# EAGLE design out8-V2.1 (EAGLE 9.6.2)
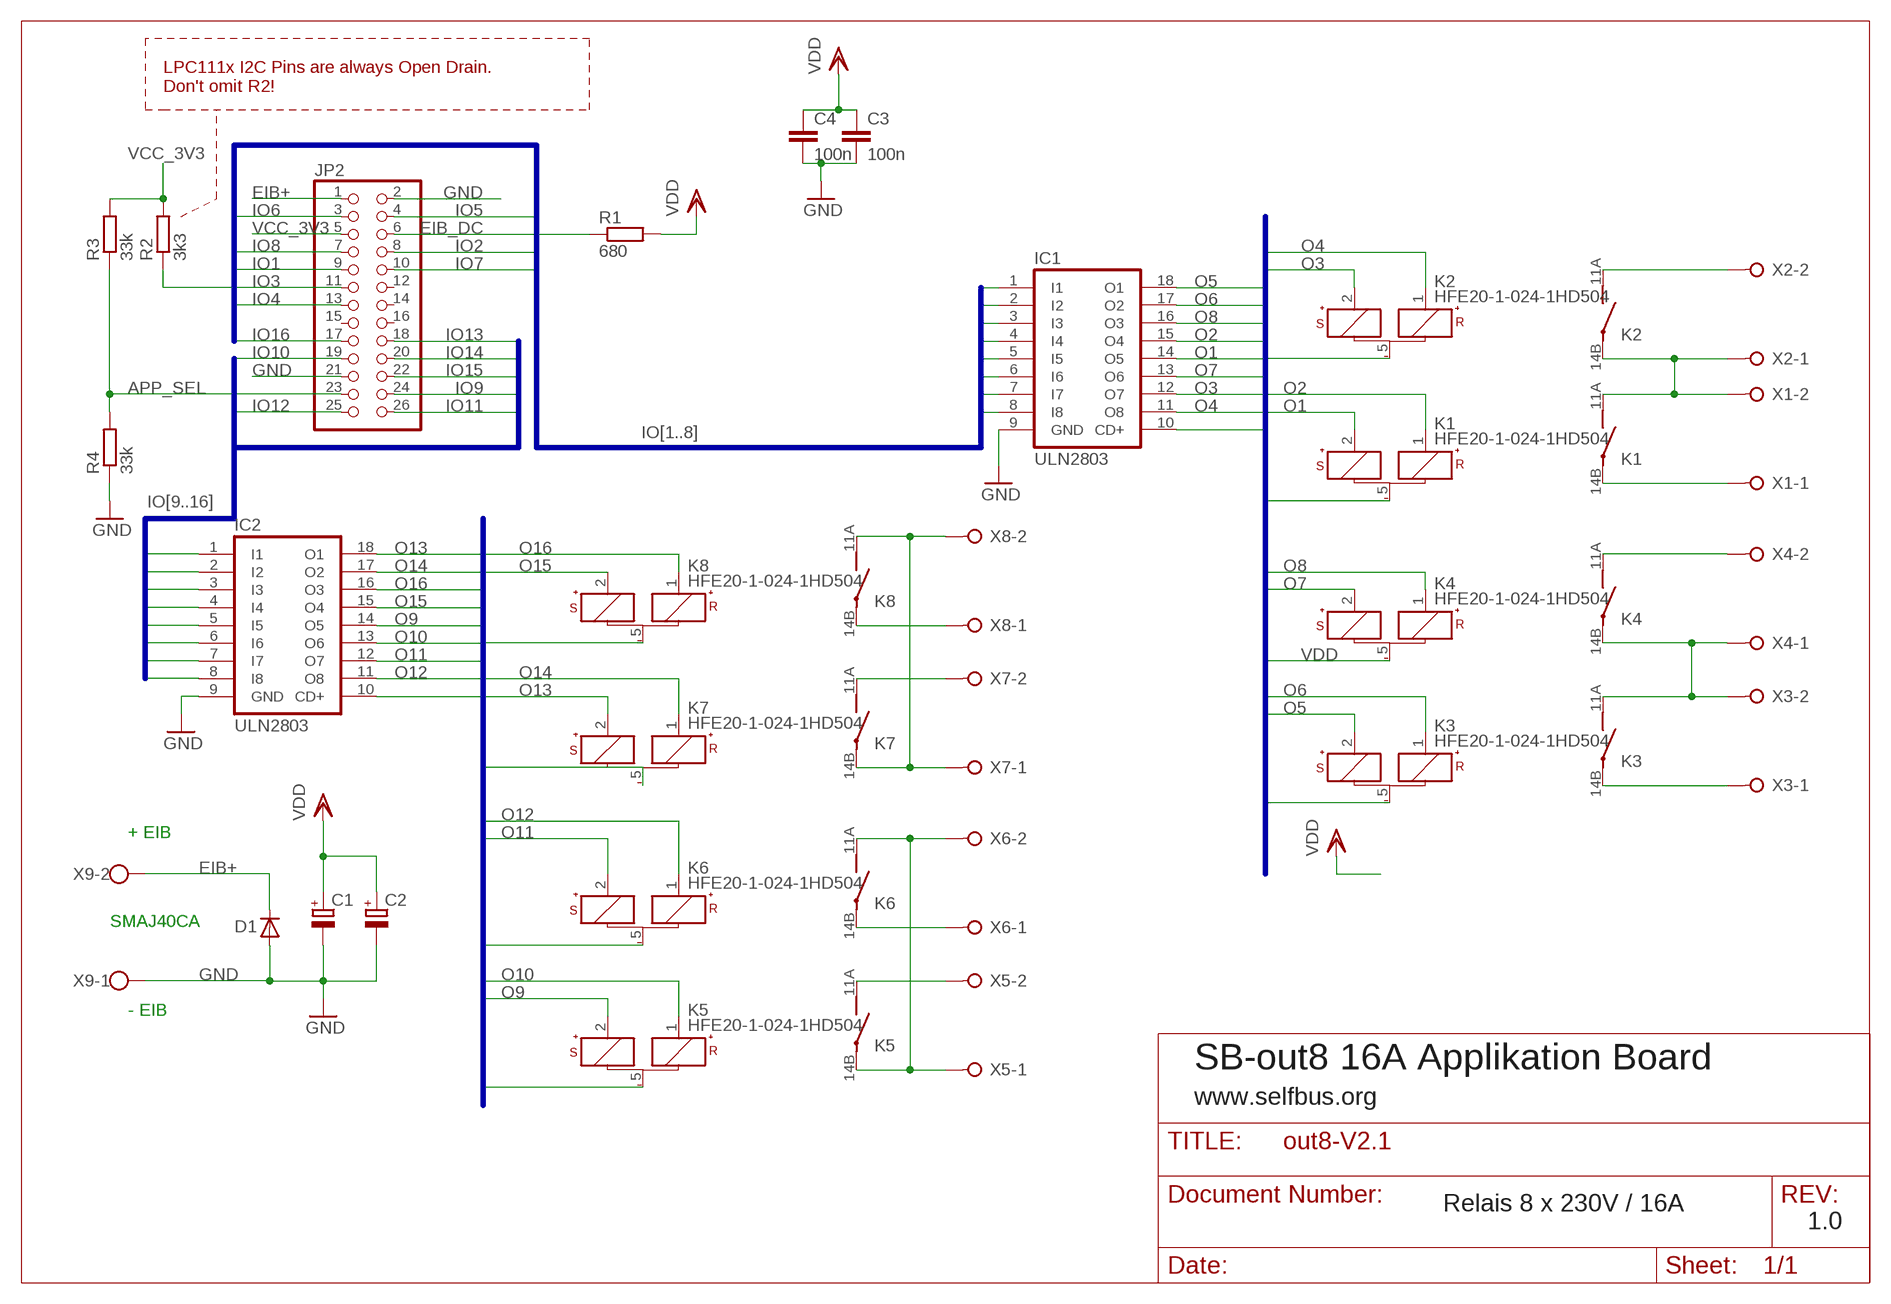
[diagram p0: schematic, sheet 1]

## Parts
C1  CPOL-EUE3.5-8  [E3,5-8]
C2  CPOL-EUE3.5-8  [E3,5-8]
C3  100n  C-EUC1206  [C1206]
C4  100n  C-EUC1206  [C1206]
D1  D-SMB  [SMB]
IC1  ULN2803  ULN2803ASOP18  [SO18W]
IC2  ULN2803  ULN2803ASOP18  [SO18W]
JP2  PINHD-2X13_2.54-SMD  [2X13SMD]
K1  HFE20-1-024-1HD504  [HFE20-3-504]
K2  HFE20-1-024-1HD504  [HFE20-3-504]
K3  HFE20-1-024-1HD504  [HFE20-3-504]
K4  HFE20-1-024-1HD504  [HFE20-3-504]
K5  HFE20-1-024-1HD504  [HFE20-3-504]
K6  HFE20-1-024-1HD504  [HFE20-3-504]
K7  HFE20-1-024-1HD504  [HFE20-3-504]
K8  HFE20-1-024-1HD504  [HFE20-3-504]
R1  680  R-EU_M1206  [M1206]
R2  3k3  R-EU_M1206  [M1206]
R3  33k  R-EU_M1206  [M1206]
R4  33k  R-EU_M1206  [M1206]
X1  W237-02P  [W237-132]
X2  W237-02P  [W237-132]
X3  W237-02P  [W237-132]
X4  W237-02P  [W237-132]
X5  W237-02P  [W237-132]
X6  W237-02P  [W237-132]
X7  W237-02P  [W237-132]
X8  W237-02P  [W237-132]
X9  W237-102  [W237-102]

## Nets
APP_SEL: JP2.23 R3.1 R4.2
EIB+: D1.1(C) JP2.1 X9.2
EIB_DC: JP2.6 R1.1
GND: C1.- C2.- C3.2 C4.2 D1.2(A) IC1.9(GND) IC2.9(GND) JP2.2 JP2.21 R4.1 X9.1
IO1: IC1.5(I5) JP2.9
IO2: IC1.4(I4) JP2.8
IO3: IC1.7(I7) JP2.11 R2.1
IO4: IC1.8(I8) JP2.13
IO5: IC1.1(I1) JP2.4
IO6: IC1.2(I2) JP2.3
IO7: IC1.6(I6) JP2.10
IO8: IC1.3(I3) JP2.7
IO9: IC2.5(I5) JP2.24
IO10: IC2.6(I6) JP2.19
IO11: IC2.7(I7) JP2.26
IO12: IC2.8(I8) JP2.25
IO13: IC2.1(I1) JP2.18
IO14: IC2.2(I2) JP2.20
IO15: IC2.4(I4) JP2.22
IO16: IC2.3(I3) JP2.17
K12: K1.11A(PB) K2.14B(PA) X1.2 X2.1
K34: K3.11A(PB) K4.14B(PA) X3.2 X4.1
K56: K5.14B(PA) K6.11A(PB) X5.1 X6.2
K78: K7.14B(PA) K8.11A(PB) X7.1 X8.2
N$1: K4.11A(PB) X4.2
N$2: K8.14B(PA) X8.1
N$3: K1.14B(PA) X1.1
N$4: K3.14B(PA) X3.1
N$8: K2.11A(PB) X2.2
N$11: K7.11A(PB) X7.2
N$13: K5.11A(PB) X5.2
N$14: K6.14B(PA) X6.1
O1: IC1.14(O5) K1.2(S+)
O2: IC1.15(O4) K1.1(R+)
O3: IC1.12(O7) K2.2(S+)
O4: IC1.11(O8) K2.1(R+)
O5: IC1.18(O1) K3.2(S+)
O6: IC1.17(O2) K3.1(R+)
O7: IC1.13(O6) K4.2(S+)
O8: IC1.16(O3) K4.1(R+)
O9: IC2.14(O5) K5.2(S+)
O10: IC2.13(O6) K5.1(R+)
O11: IC2.12(O7) K6.2(S+)
O12: IC2.11(O8) K6.1(R+)
O13: IC2.18(O1) K7.2(S+)
O14: IC2.17(O2) K7.1(R+)
O15: IC2.15(O4) K8.2(S+)
O16: IC2.16(O3) K8.1(R+)
VCC_3V3: JP2.5 R2.2 R3.2
VDD: C1.+ C2.+ C3.1 C4.1 IC1.10(CD+) IC2.10(CD+) K1.5(-) K2.5(-) K3.5(-) K4.5(-) K5.5(-) K6.5(-) K7.5(-) K8.5(-) R1.2
Unconnected: JP2.12 JP2.14 JP2.15 JP2.16

## Buses
IO[1..8]
O[1..8],VDD
O[9..16],VDD
IO[9..16]

## Notes on the sheet
- LPC111x I2C Pins are always Open Drain.
  Don't omit R2!
- + EIB
- SMAJ40CA
- - EIB
- SB-out8 16A Applikation Board
- www.selfbus.org
- Relais 8 x 230V / 16A
- 1.0

## Library data of the parts
C1 C2 = rcl:CPOL-EU: POLARIZED CAPACITOR, European symbol
C3 C4 = rcl:C-EU: CAPACITOR, European symbol
D1 = semicon-smd-ipc:D-: DIODE unfilled
IC1 IC2 = uln-udn:ULN2803A: DRIVER ARRAY
JP2 = pinhead:PINHD-2X13: PIN HEADER
K1-K8 = sb-relay:HFE20-1-024-1HD
R1-R4 = rcl:R-EU_: RESISTOR, European symbol
X1-X8 = con-wago-508:W237-02P: WAGO SREW CLAMP; OC_FARNELL: unknown; OC_NEWARK: unknown
X9 = con-wago-500:W237-102: WAGO SCREW CLAMP

## Net classes
1 230Vac: width 1.93 mm, clearance 5.08 mm to class 0, clearance 1.905 mm

## Board
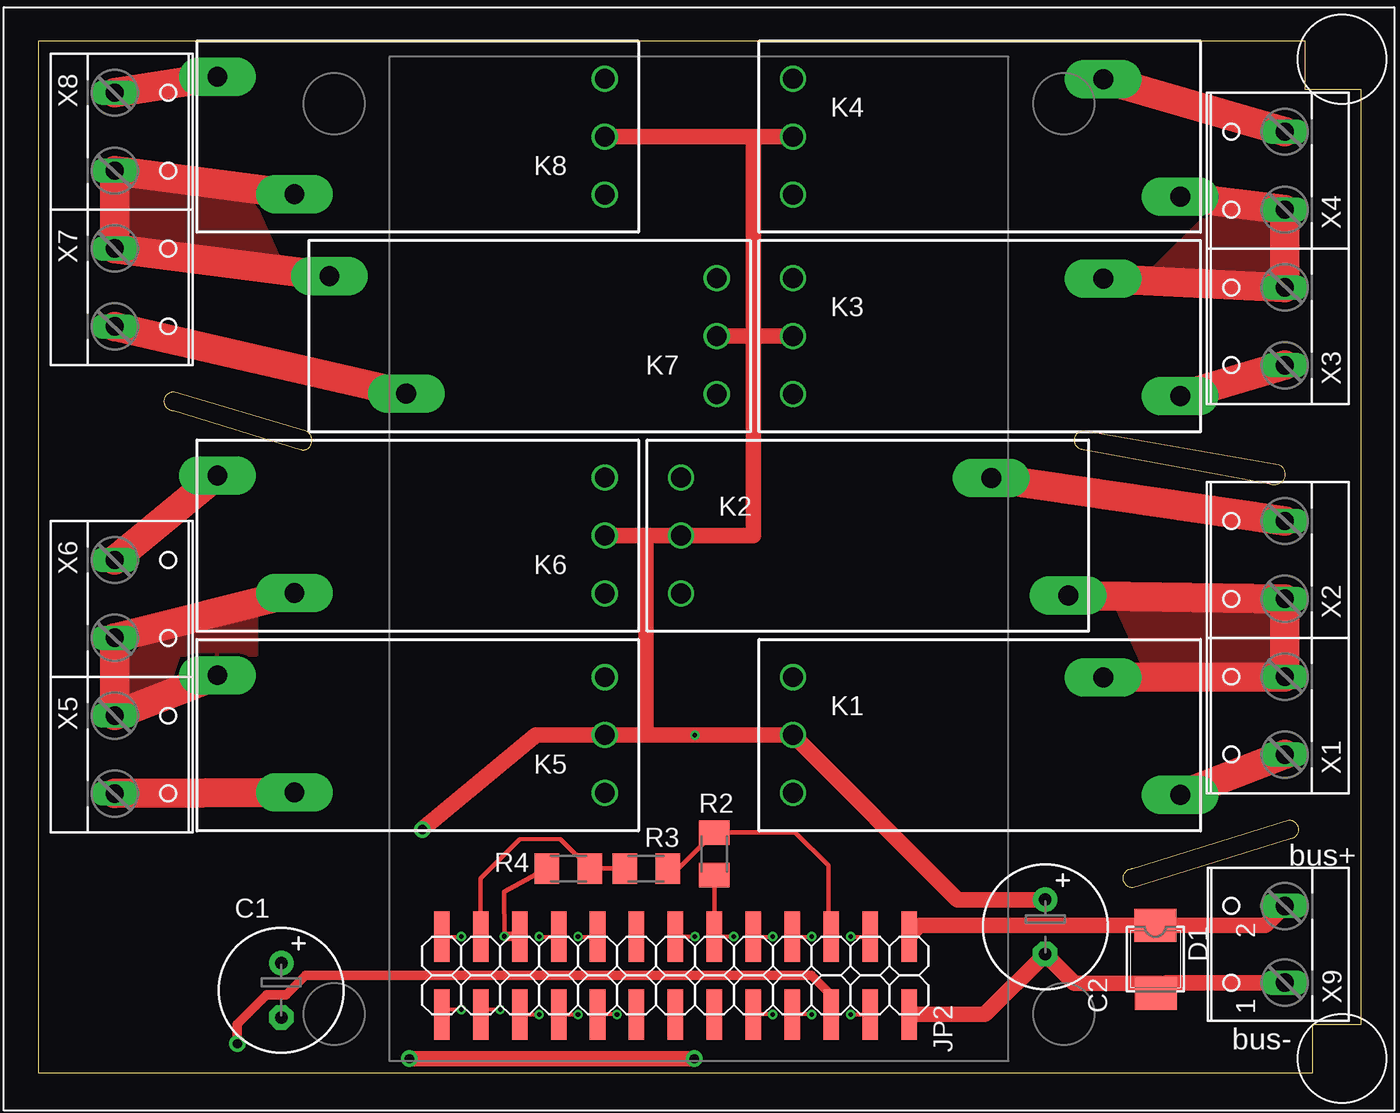
[diagram p1: board, top side]
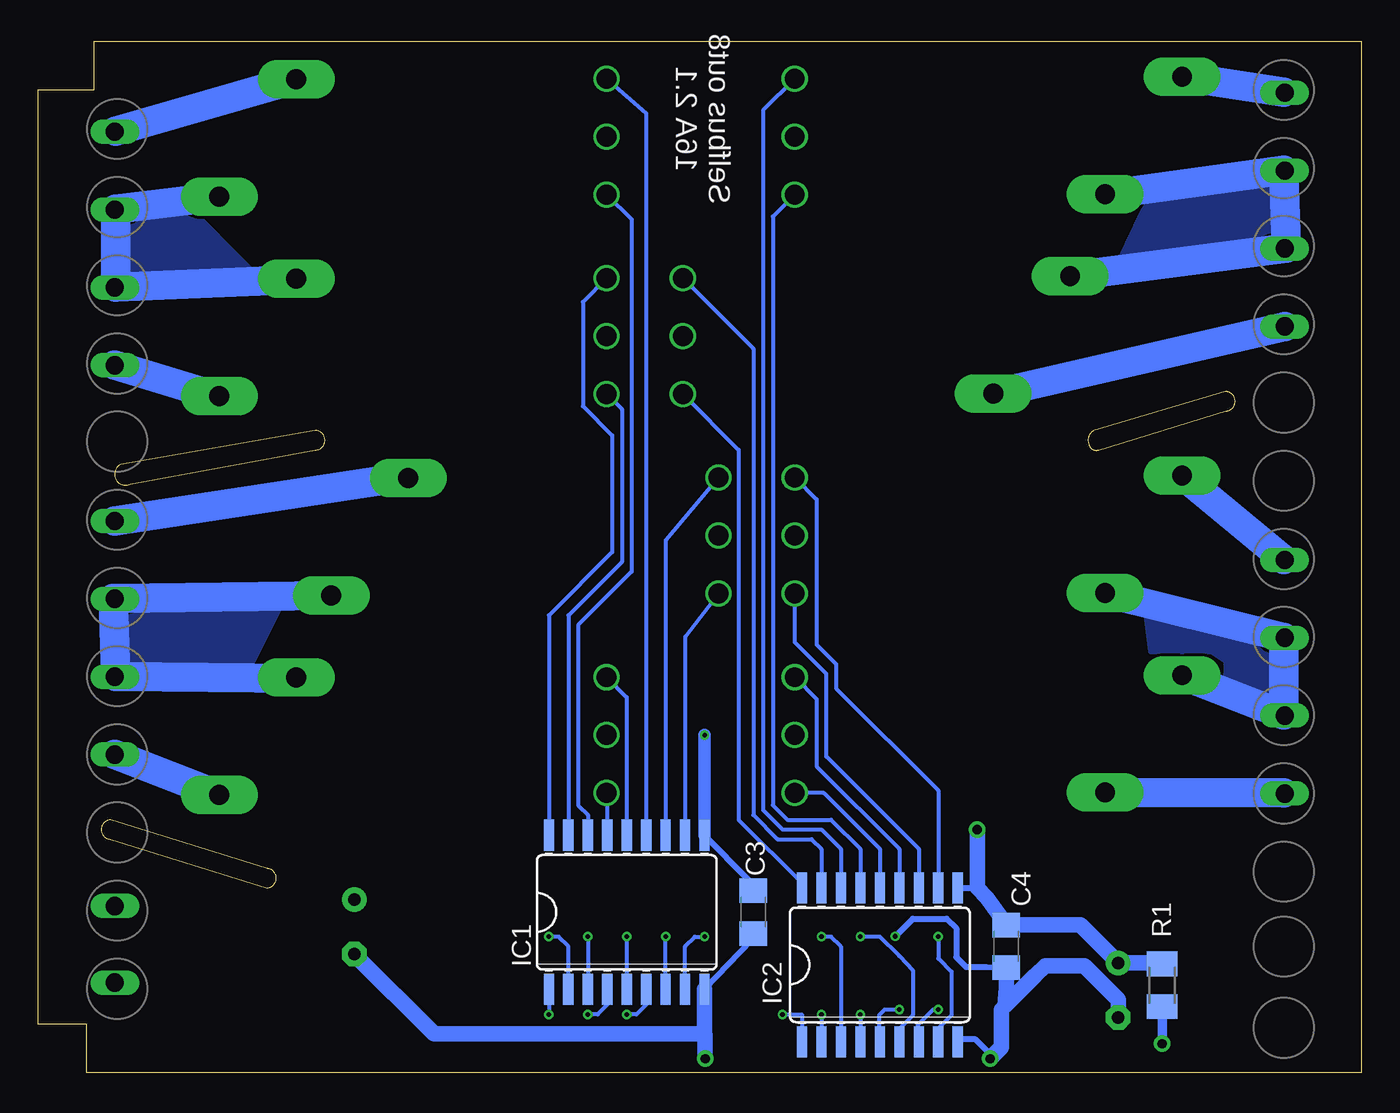
[diagram p2: board, bottom side, seen from below]

Size 86.3 x 67.31 mm. Coordinates in mm from the lower left corner, seen from the top.
Outline: 8.22,43.81 arc-90 8.86,44.45 17.43,41.91 arc-90 17.75,40.96 arc-90 17.11,40.64 8.86,43.18 arc-90 8.22,43.81
Outline: 67.6,41.27 arc-90 68.23,41.91 80.93,39.69 arc-90 81.25,38.73 arc-90 80.3,38.42 68.23,40.64 arc-90 67.6,41.27
Outline: 70.77,12.7 arc-90 71.41,13.33 81.57,16.51 arc-90 82.2,15.87 arc-90 81.57,15.24 71.41,12.06 arc-90 70.77,12.7
Copper layers (1*16): Top 0.035mm / dielectric 1.5mm / Bottom 0.035mm
Design rules "PCB-POOL Standard *": minimum track width 0.15mm, minimum drill 0.3mm, track to track 0.15mm, track to pad 0.15mm, pad to pad 0.15mm, via to via 0.15mm, smd to smd 0.15mm, copper to edge 0.3mm, drill to drill 0.2mm, minimum pad ring 0.2mm, minimum via ring 0.15mm, stop-mask expansion 0.075mm, vias tented up to drill 0.35mm, thermal gap 0.2mm

### Footprints (pad centres in the part's own frame; a part is rotated, then mirrored left to right if it is on the bottom)
E3,5-8 = drill 0.813 pad 1.6: + -1.778,0 | drill 0.813 pad 1.6 octagon: - 1.778,0
C1206 = smd 1.6 x 1.8: 1 -1.4,0; 2 1.4,0
SMB = smd 2.159 x 2.743: 1 -2.311,-0.127; 2 2.108,-0.102
SO18W = smd 0.66 x 2.032: 1 -5.08,-5.029; 2 -3.81,-5.029; 3 -2.54,-5.029; 4 -1.27,-5.029; 5 0,-5.029; 6 1.27,-5.029; 7 2.54,-5.029; 8 3.81,-5.029; 9 5.08,-5.029; 10 5.08,5.029; 11 3.81,5.029; 12 2.54,5.029; 13 1.27,5.029; 14 0,5.029; 15 -1.27,5.029; 16 -2.54,5.029; 17 -3.81,5.029; 18 -5.08,5.029
2X13SMD = smd 1.016 x 3.302: 1 -1.27,-3.81; 2 -1.27,1.27; 3 1.27,-3.81; 4 1.27,1.27; 5 3.81,-3.81; 6 3.81,1.27; 7 6.35,-3.81; 8 6.35,1.27; 9 8.89,-3.81; 10 8.89,1.27; 11 11.43,-3.81; 12 11.43,1.27; 13 13.97,-3.81; 14 13.97,1.27; 15 16.51,-3.81; 16 16.51,1.27; 17 19.05,-3.81; 18 19.05,1.27; 19 21.59,-3.81; 20 21.59,1.27; 21 24.13,-3.81; 22 24.13,1.27; 23 26.67,-3.81; 24 26.67,1.27; 25 29.21,-3.81; 26 29.21,1.27
HFE20-3-504 = drill 1.3: 1 -12.6,-3.78; 2 -12.6,3.78; 5 -12.6,0 | drill 1.3 pad 2.5 long: 11A 7.65,3.75; 14B 12.67,-3.91
M1206 = smd 1.6 x 2: 1 -1.4,0; 2 1.4,0
W237-132 = drill 1.194 long: 1 -2.54,-0.635; 2 2.54,-0.635
W237-102 = drill 1.194 long: 1 -2.5,-1.27; 2 2.5,-1.27

### Placement (x,y rotation side)
C1  15.85,5.4 270 top
C2  65.69,9.52 270 top
C3  39.66,10.48 270 bottom
C4  23.16,8.25 270 bottom
D1  73,7.3 270 top
IC1  47.91,10.48 0 bottom
IC2  31.4,7.05 0 bottom
JP2  55.53,5.08 180 top
K1  61.82,22.03 0 top
K2  54.52,35.05 0 top
K3  61.82,48.07 0 top
K4  61.82,61.09 0 top
K5  24.35,22.03 180 top
K6  24.35,35.05 180 top
K7  31.66,48.07 180 top
K8  24.35,61.09 180 top
R1  12.99,5.71 90 bottom
R2  44.1,14.29 90 top
R3  39.66,13.33 0 top
R4  34.58,13.33 0 top
U$1  [HUT4C-NO-DRILL]  -2.25,69.53 270 top
X1  80.68,23.3 90 top
X2  80.68,33.46 90 top
X3  80.68,48.7 90 top
X4  80.68,58.86 90 top
X5  5.62,20.76 270 top
X6  5.62,30.92 270 top
X7  5.62,51.24 270 top
X8  5.62,61.4 270 top
X9  80.04,8.38 90 top

### Tracks (layer width: path | path; a pad name or v marks a point on that pad's centre or on a via)
APP_SEL
  Top 0.254: 34.07,15.24 31.4,15.24
  Top 0.305: R3.1 R4.2 34.07,15.24 | 31.4,15.24 28.86,12.7 JP2.23
EIB+
  Top 1.016: X9.2 80.05,9.61 D1.1 57.53,9.61 JP2.1
EIB_DC  (via drill 0.6)
  Top 0.61: JP2.6 51.72,5.08 50.45,6.35 17.43,6.35 16.16,5.08 14.89,5.08 12.99,3.17 v12.99,1.9
  Top 0.813: JP2.6 51.72,3.17
  Bottom 0.61: v12.99,1.9 R1.1
GND  (via drill 0.3, 0.6)
  Top 0.305: R4.1 30.39,11.82 v30.41,8.91
  Top 0.61: v30.41,8.91 31.39,8.91 JP2.21
  Top 0.813: 72.68,5.88 72.89,5.67 D1.2
  Top 1.016: D1.2 73.36,5.66 | 73.36,5.66 73.58,5.88 X9.1 | 73.36,5.66 73.19,5.84 67.6,5.84 C2.- 61.76,3.81 JP2.2 | v24.21,0.92 v42.79,0.92
  Bottom 0.406: C3.2 39.75,8.66 IC1.9 | 26.1,2.24 IC2.9 26.16,2.18 25.15,2.18 24.21,1.24 v24.21,0.92 | v30.41,8.91 v30.4,8.91 29.25,10.06 27.04,10.06 26.41,9.43 26.41,7.54 25.78,6.91 24.47,6.91 C4.2
  Bottom 0.61: 21.56,6.35 21.24,6.35
  Bottom 1.016: IC1.9 42.83,2.54 | 42.83,2.54 60.49,2.54 C2.- | 23.23,4.36 23.48,4.11 23.48,1.65 v24.21,0.92 | 23.23,4.36 21.24,6.35 20.61,6.98 18.07,6.98 15.85,4.76 C1.- | v42.79,0.92 42.79,2.5 42.83,2.54 | C4.2 23.16,5.54 23.23,4.36
  pour Bottom (isolate 6.452): 12.99,9.52 12.99,1.27 59.34,1.27 59.34,8.89 58.07,8.89 53.63,13.33 53.63,29.84 49.82,33.65 49.82,41.91 51.09,43.18 51.09,66.04 35.85,66.04 35.85,55.88 38.39,53.34 38.39,42.54 35.21,39.37 35.21,22.86 34.58,22.86 21.24,9.52
  pour Top (isolate 6.452): 12.99,1.27 59.34,1.27 59.34,10.16 56.8,10.16 53.63,13.33 53.63,29.84 49.82,33.65 49.82,41.91 51.09,43.18 51.09,66.04 35.85,66.04 35.85,55.88 38.39,53.34 38.39,42.54 35.21,39.37 35.21,22.86 21.88,9.52 13.62,9.52 12.99,9.52
IO1  (via drill 0.3)
  Top 0.254: JP2.9 v47.91,8.89
  Bottom 0.254: v47.91,8.89 IC1.5
IO2  (via drill 0.3)
  Top 0.254: v50.45,3.81 JP2.8
  Bottom 0.254: IC1.4 49.18,4.44 49.82,3.81 v50.45,3.81
IO3  (via drill 0.3)
  Top 0.254: v45.37,8.89 JP2.11
  Top 0.305: R2.1 JP2.11
  Bottom 0.254: IC1.7 v45.37,8.89
IO4  (via drill 0.3)
  Top 0.254: v42.83,8.89 JP2.13
  Bottom 0.254: IC1.8 44.1,8.25 43.47,8.89 v42.83,8.89
IO5  (via drill 0.3)
  Top 0.254: v52.99,3.81 JP2.4
  Bottom 0.254: IC1.1 v52.99,3.81
IO6  (via drill 0.3)
  Top 0.254: v52.99,8.89 JP2.3
  Bottom 0.254: IC1.2 51.72,8.25 52.36,8.89 v52.99,8.89
IO7  (via drill 0.3)
  Top 0.254: v47.91,3.81 JP2.10
  Bottom 0.254: IC1.6 46.64,4.44 47.28,3.81 v47.91,3.81
IO8  (via drill 0.3)
  Top 0.254: JP2.7 v50.45,8.89
  Bottom 0.254: v50.45,8.89 IC1.3
IO9  (via drill 0.3)
  Top 0.254: v30.13,4.12 29.18,4.12 JP2.24
  Bottom 0.254: v30.13,4.12 31.09,4.12 31.45,3.76 31.45,2.07 IC2.5
IO10  (via drill 0.3)
  Top 0.254: v32.67,8.89 JP2.19
  Bottom 0.254: v32.67,8.89 31.4,8.89 30.13,7.62 29.25,6.67 29.25,3.76 30.19,2.81 30.19,2.08 IC2.6
IO11  (via drill 0.3)
  Top 0.254: v27.59,4.12 26.64,4.12 JP2.26
  Bottom 0.254: v27.59,4.12 27.94,4.12 28.93,3.13 28.93,2.09 IC2.7
IO12  (via drill 0.3)
  Top 0.254: JP2.25 v27.59,8.89
  Bottom 0.254: v27.59,8.89 27.59,7.46 26.73,6.59 26.73,3.76 27.67,2.81 27.67,2.1 IC2.8
IO13  (via drill 0.3)
  Top 0.254: v37.75,3.81 JP2.18
  Bottom 0.254: v37.75,3.81 JP2.18 IC2.1
IO14  (via drill 0.3)
  Top 0.254: JP2.20 v35.21,3.81
  Bottom 0.254: v35.21,3.81 IC2.2
IO15  (via drill 0.3)
  Top 0.254: JP2.22 v32.67,3.81
  Bottom 0.254: v32.67,3.81 IC2.4
IO16  (via drill 0.3)
  Top 0.254: v35.21,8.89 JP2.17
  Bottom 0.254: v35.21,8.89 34.58,8.89 33.94,8.25 IC2.3
K12
  Top 1.93: K1.11A X1.2 X2.1 K2.14B
  Bottom 1.93: K2.14B 81.41,30.96 81.25,25.88 69.19,25.72
  pour Bottom: 72.68,26.03 81.57,26.03 81.57,31.11 70.14,31.11
  pour Top: 81.57,31.11 81.57,26.03 72.36,26.03 69.98,31.27 81.41,31.27
K34
  Top 1.93: K3.11A X3.2 X4.1 K4.14B
  Bottom 1.93: K4.14B 81.25,56.36 81.25,51.28 69.5,51.75
  pour Bottom: 81.57,51.43 81.57,56.51 77.12,57.15 72.04,52.07 81.41,51.12
  pour Top: 81.57,56.51 81.57,51.43 72.2,51.91 76.96,56.67
K56
  Top 1.93: K6.11A X6.2 X5.1 K5.14B
  Bottom 1.93: K5.14B 5.05,23.34 5.05,28.42 16.64,31.27 16.8,31.11
  pour Bottom: 14.26,31.11 13.78,27.46 9.81,27.46 8.86,26.83 8.86,26.19 9.02,25.24 4.89,23.18 4.89,28.42
  pour Top: 5.37,23.49 8.54,25.4 9.18,27.3 14.26,27.3 14.26,31.11 5.37,28.57
K78
  Top 1.93: K8.11A X8.2 X7.1 K7.14B
  Bottom 1.93: K7.14B 4.89,53.82 5.05,58.9 16.64,57.31
  pour Bottom: 4.73,53.97 5.05,58.9 13.62,57.63 16.16,52.23 4.73,53.82
  pour Top: 4.73,59.05 4.73,53.97 16.16,52.07 13.62,57.78
N$1
  Top 1.93: X4.2 K4.11A
  Bottom 1.93: K4.11A 81.25,61.44
N$2
  Top 1.93: K8.14B X8.1
  Bottom 1.93: K8.14B 5.05,63.98
N$3
  Top 1.93: K1.14B X1.1
  Bottom 1.93: X1.1 74.42,18.1
N$4
  Top 1.93: K3.14B X3.1
  Bottom 1.93: X3.1 74.58,44.13
N$8
  Top 1.93: X2.2 K2.11A
  Bottom 1.93: X2.2 62.2,38.89
N$11
  Top 1.93: X7.2 K7.11A
  Bottom 1.93: X7.2 24.1,44.29
N$13
  Top 1.93: X5.2 K5.11A
  Bottom 1.93: K5.11A 5.05,18.26
N$14
  Top 1.93: K6.14B X6.1
  Bottom 1.93: K6.14B 5.05,33.5
O1
  Bottom 0.254: K1.2 47.91,24.51 IC1.14
O2
  Bottom 0.254: K1.1 49.18,18.22 IC1.15
O3
  Bottom 0.254: K2.2 45.37,34.74 IC1.12
O4
  Bottom 0.254: K2.1 44.1,28.45 IC1.11
O5
  Bottom 0.254: K3.2 50.77,50.3 50.77,43.5 48.86,41.59 48.86,33.97 52.99,29.84 IC1.18
O6
  Bottom 0.254: K3.1 48.23,43.3 48.23,33.34 51.72,29.84 IC1.17
O7
  Bottom 0.254: K4.2 46.64,62.61 IC1.13
O8
  Bottom 0.254: K4.1 47.59,55.68 47.59,32.7 51.09,29.21 51.09,17.46 50.45,16.83 IC1.16
O9
  Bottom 0.254: K5.2 35.05,18.25 31.4,14.6 IC2.14
O10
  Bottom 0.254: K5.1 35.53,24.39 35.53,20 30.13,14.6 IC2.13
O11
  Bottom 0.254: K6.2 36.95,28.09 34.9,26.03 34.9,20.64 28.86,14.6 IC2.12
O12
  Bottom 0.254: K6.1 35.53,37.41 35.53,27.94 34.26,26.67 34.26,25.08 27.59,18.41 IC2.11
O13
  Bottom 0.254: K7.2 40.61,40.64 40.61,16.51 36.45,12.35 IC2.18
O14
  Bottom 0.254: K7.1 39.66,47.25 39.66,16.83 38.07,15.24 35.85,15.24 35.21,14.6 IC2.17
O15
  Bottom 0.254: K8.2 38.39,55.87 38.39,17.46 37.44,16.51 34.58,16.51 32.67,14.6 IC2.15
O16
  Bottom 0.254: K8.1 39.02,62.8 39.02,17.14 37.75,15.87 35.21,15.87 33.94,14.6 IC2.16
VCC_3V3
  Top 0.254: 41.75,13.33 R3.2
  Top 0.305: JP2.5 51.54,9.08 51.54,13.52 49.37,15.69 R2.2 41.75,13.33
VDD  (via drill 0.3, 0.6)
  Top 0.61: K5.5 39.66,22.03 v42.83,22.03
  Top 1.016: K8.5 46.64,61.09 | 46.64,61.09 K4.5 | 46.64,48.07 K7.5 | K3.5 46.64,48.07 | 46.64,48.07 46.64,61.09 | K6.5 39.66,35.05 | 39.66,35.05 K2.5 46.64,35.05 46.64,48.07 | 39.66,22.03 39.66,35.05 | C2.+ 59.95,11.3 K1.5 v42.83,22.03 K5.5 32.48,22.03 v25.05,15.87
  Bottom 0.406: IC1.10 39.98,12.6 C3.1 | IC2.10 25.07,12.08 25.05,12.06
  Bottom 0.813: IC1.10 v42.83,22.03
  Bottom 1.016: R1.2 13.05,7.18 C1.+ 18.32,9.65 C4.1 24.42,11.43 25.05,12.06 v25.05,15.87

### Text on the board
bPlace: Selfbus out8 / 16A 2.1
tNames: bus+ | bus-